# Altium project LAB2_BSEE23018.PrjPcb
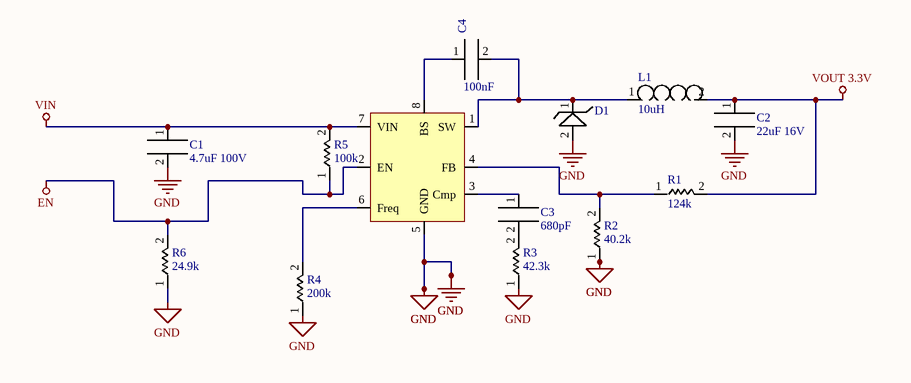
[diagram p0: Sheet1.SchDoc]
1 sheet, 13 parts. Net scope: global (net labels, ports and power ports of the same name join across sheets).
Board files: PCB2.PcbDoc, PCB1.PcbDoc

## Sheet Sheet1.SchDoc
size A; SheetNumber: 1; SheetTotal: 1

### Parts
C1  4.7uF 100V  [CAPC1005X06N]
C2  22uF 16V  [CAPC1005X06N]
C3  680pF  [CAPC1005X06N]
C4  100nF  [CAPC1005X06N]
D1  Schottky  [sss]  (value not drawn)
L1  10uH  [INDUCTOR]
MP4560DN**  Component_1  [SOIC127P600X170_HS-9N]  (value not drawn)
R1  124k  [DIOMELF3516N]
R2  40.2k  [DIOMELF3516N]
R3  42.3k  [DIOMELF3516N]
R4  200k  [DIOMELF3516N]
R5  100k  [DIOMELF3516N]
R6  24.9k  [DIOMELF3516N]

### Nets
EN: MP4560DN**.2(EN) R5.1 R6.2
GND: C1.2 C2.2 D1.2 MP4560DN**.5(GND) R2.1 R3.1 R4.1 R6.1
VIN: C1.1(C7) MP4560DN**.7(VIN) R5.2
VOUT 3.3V: C2.1(C7) L1.2 R1.2
NetC3_1: C3.1(C7) MP4560DN**.3(Cmp)
NetC3_2: C3.2 R3.2
NetC4_1: C4.1(C7) MP4560DN**.8(BS)
NetC4_2: C4.2 D1.1 L1.1 MP4560DN**.1(SW)
NetMP4560DN**_4: MP4560DN**.4(FB) R1.1 R2.2
NetMP4560DN**_6: MP4560DN**.6(Freq) R4.2

### Library data of the parts
C1-C4 R1-R6 = Component_1
L1 = Inducor: 4.7 µH Shielded Drum Core, Wirewound Inductor 2.9 A 35mOhm Max Nonstandard; Manufactureer: Würth Elektronik; Manufacturer part no:: 7447789004
MP4560DN** = Component_1: MP4560 / 2A, 2MHz, 55V / Step-Down Converter; Manufacturer: Monolothic Power; Manufacturer part no: MP4560DN**